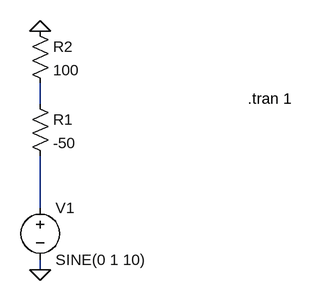
[diagram p0: schematic Draft3.asc]
Draft3.asc, the LTspice schematic file:
Version 4
SHEET 1 880 680
WIRE 32 144 32 112
WIRE 32 304 32 224
WIRE 32 400 32 384
FLAG 32 400 0
FLAG 32 32 0
SYMBOL Voltage 32 288 R0
SYMATTR InstName V1
SYMATTR Value SINE(0 1 10)
SYMBOL Res 16 128 R0
SYMATTR InstName R1
SYMATTR Value -50
SYMBOL Res 16 16 R0
SYMATTR InstName R2
SYMATTR Value 100
TEXT 352 136 Left 2 !.tran 1

The netlist it stands for:
* Draft3.asc
V1 N002 0 SINE(0 1 10)
R1 N001 N002 -50
R2 0 N001 100
.tran 1
.backanno
.end